# EAGLE schematic PMOD to BeagleWire Debug - CRRYEK (EAGLE 9.1.3)
LICENSE: CC BY-SA 4.0; REV: CRRYEK; TITLE: PMOD BeagleWire Debug Adapter; URL: https://github.com/CapableRobot/PMOD-Adapters
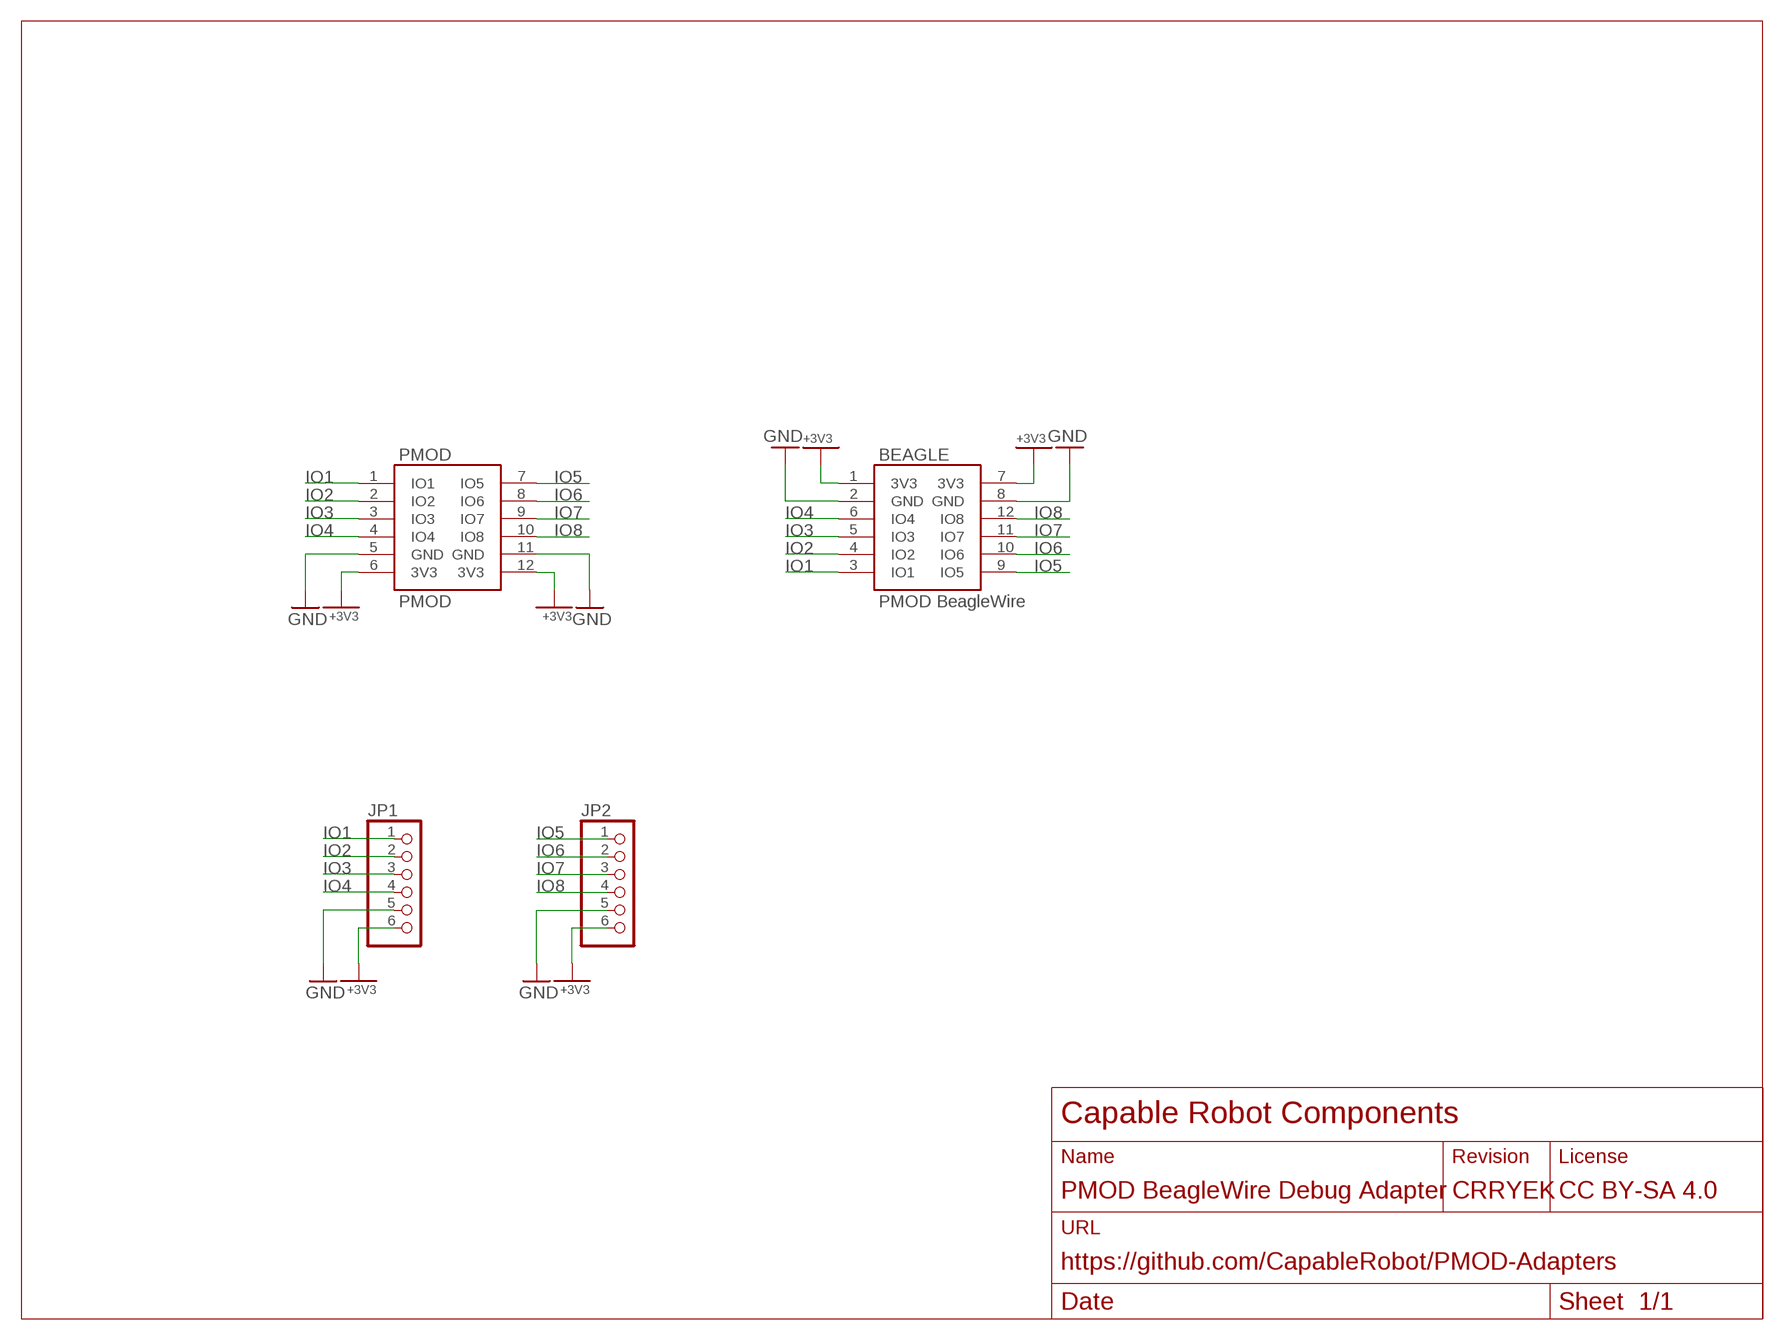
[diagram p0: schematic, sheet 1]

## Parts
BEAGLE  PMOD-BEAGLEWIRE  [HDRRA12W64P254_2X6_1524X254X556B]
JP1  PINHD-1X6  [1X06]
JP2  PINHD-1X6  [1X06]
PMOD  PMOD-HOST  [HDRRAR12W64P254_2X6_1524X736X556B]

## Nets
+3V3: BEAGLE.1(3V3) BEAGLE.7(3V3) JP1.6 JP2.6 PMOD.6(3V3) PMOD.12(3V3)
GND: BEAGLE.2(GND) BEAGLE.8(GND) JP1.5 JP2.5 PMOD.5(GND) PMOD.11(GND)
IO1: BEAGLE.3(IO1) JP1.1 PMOD.1(IO1)
IO2: BEAGLE.4(IO2) JP1.2 PMOD.2(IO2)
IO3: BEAGLE.5(IO3) JP1.3 PMOD.3(IO3)
IO4: BEAGLE.6(IO4) JP1.4 PMOD.4(IO4)
IO5: BEAGLE.9(IO5) JP2.1 PMOD.7(IO5)
IO6: BEAGLE.10(IO6) JP2.2 PMOD.8(IO6)
IO7: BEAGLE.11(IO7) JP2.3 PMOD.9(IO7)
IO8: BEAGLE.12(IO8) JP2.4 PMOD.10(IO8)

## Library data of the parts
BEAGLE = CapableRobot:PMOD-BEAGLEWIRE
JP1 JP2 = adafruit:PINHD-1X6: PIN HEADER
PMOD = CapableRobot:PMOD